# Altium schematic sheet FPGA_IO.SchDoc
size A2
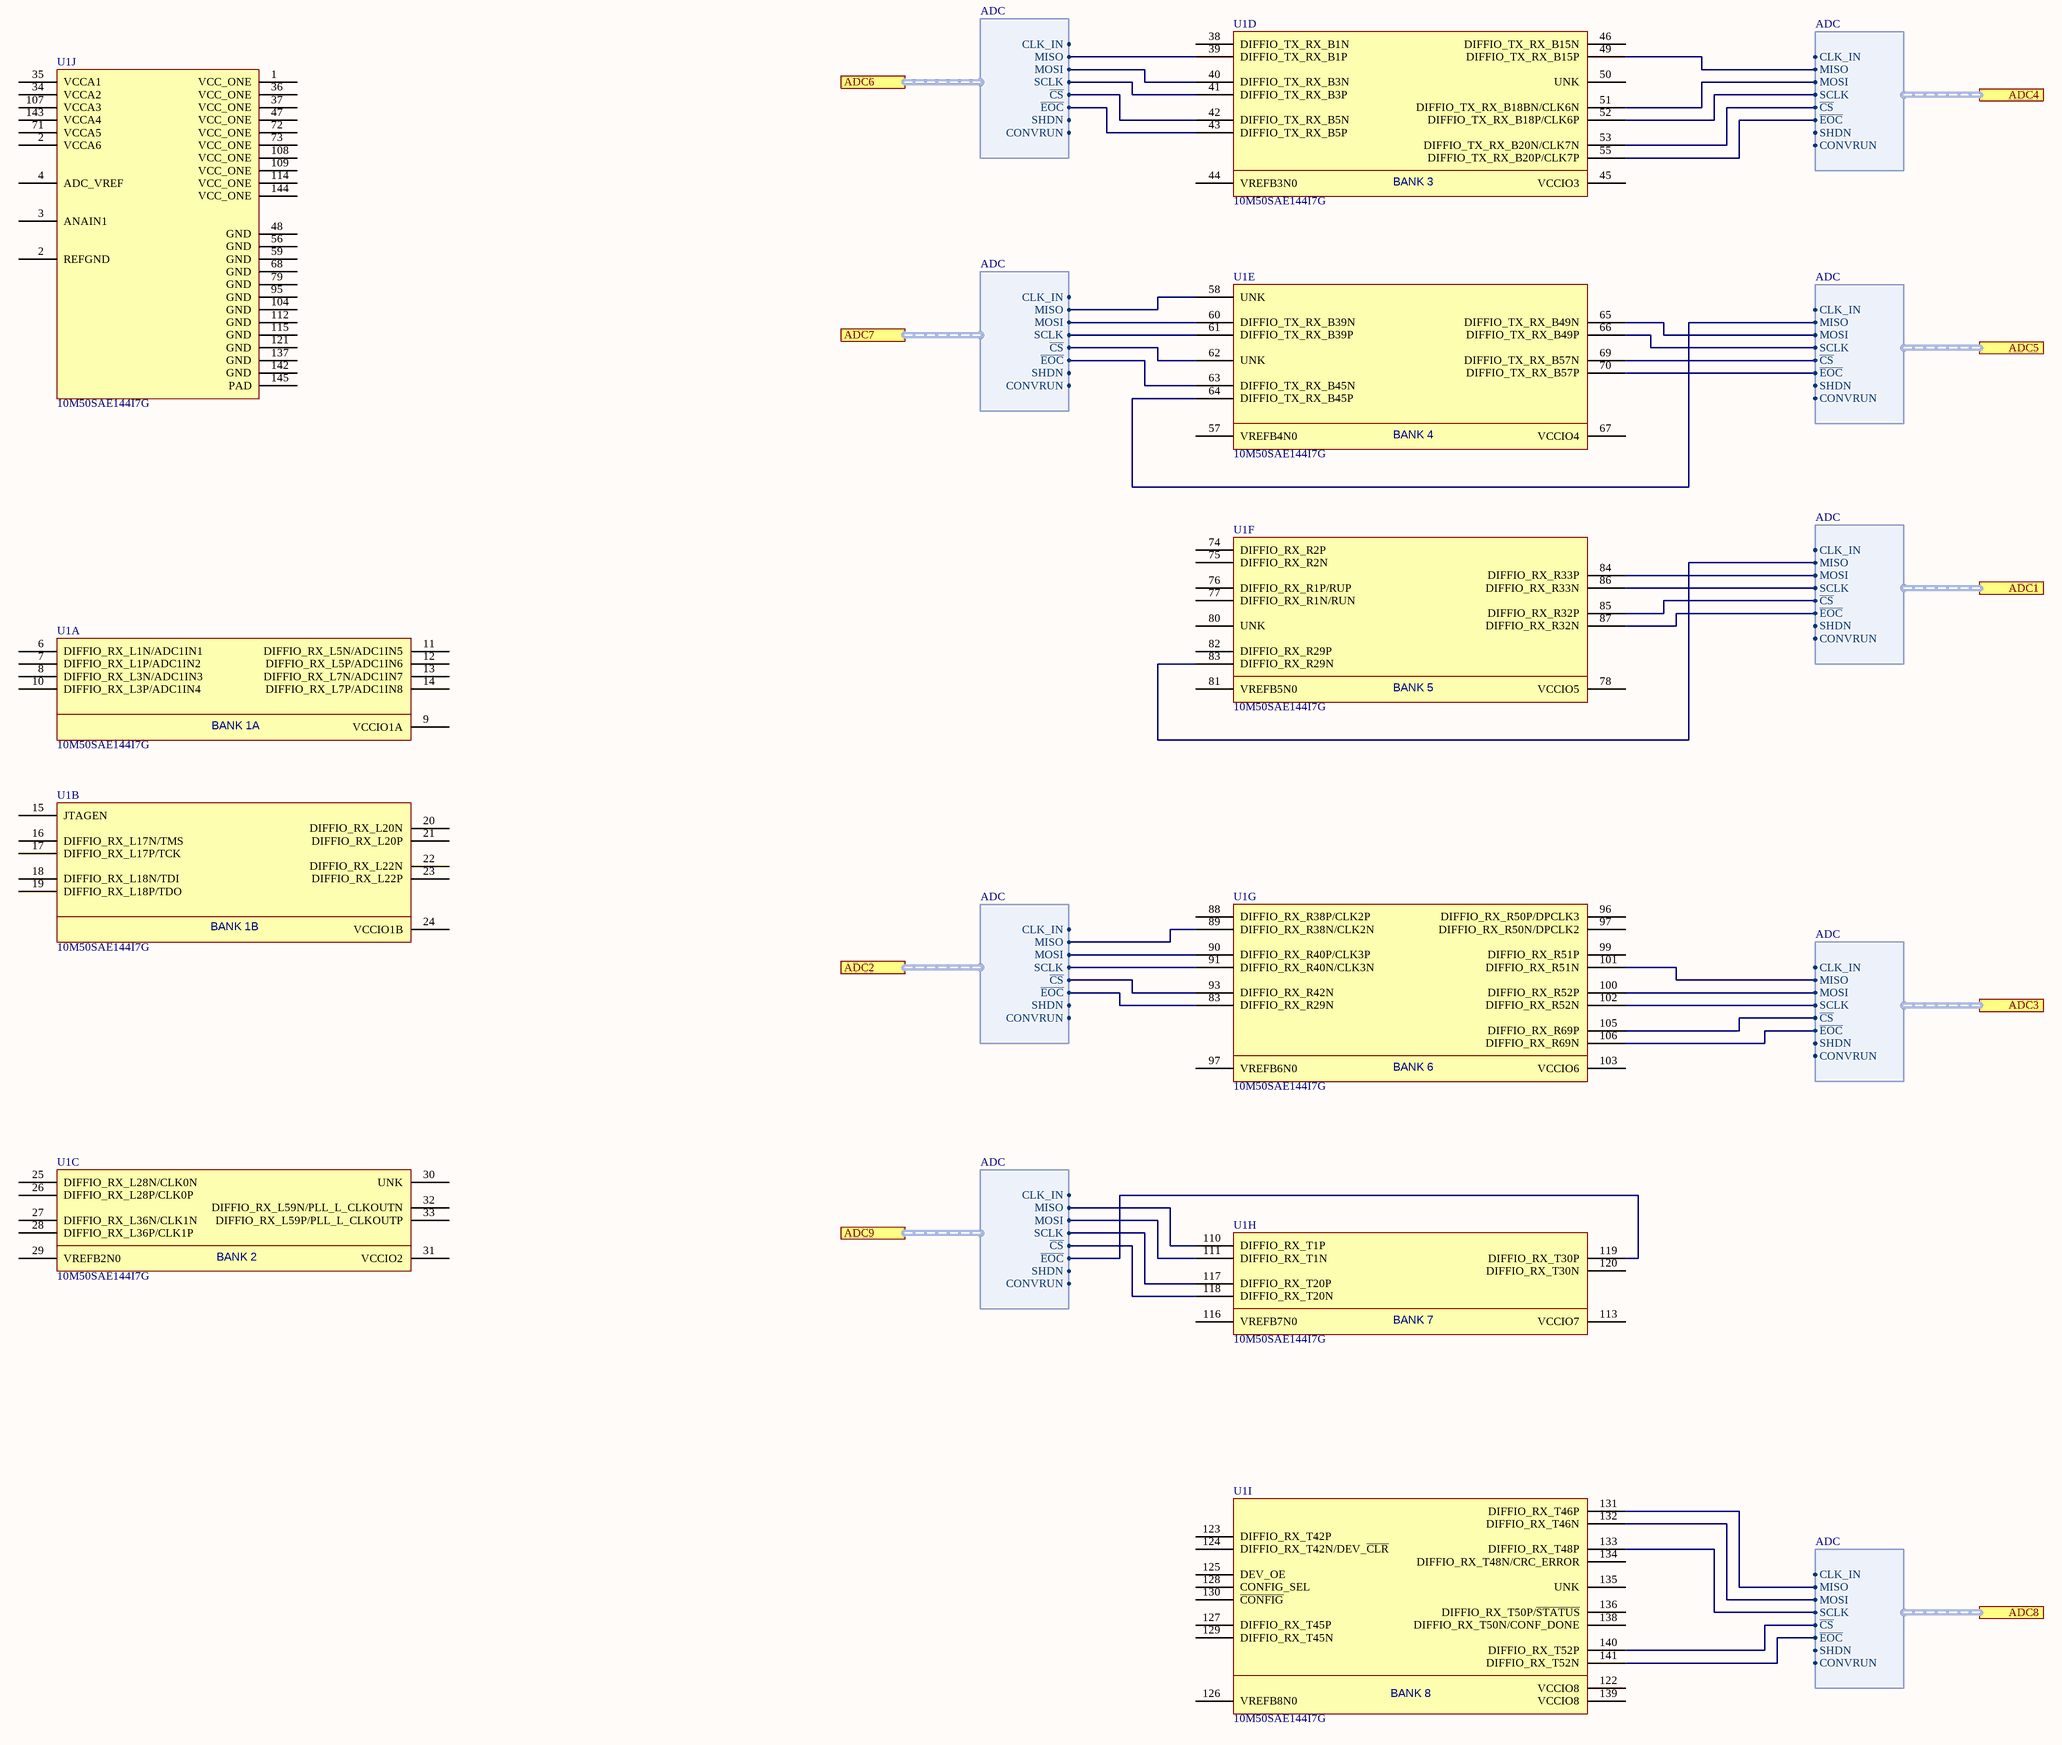
[diagram p0: FPGA_IO.SchDoc]

## Parts
U1  10M50SAE144I7G  [TSQFP50P2200X2200X160_HS-145N]  (parts A,B,C,D,E,F,G,H,I,J of 10)

## Ports
ADC1 (harness ADC), ADC2 (harness ADC), ADC3 (harness ADC), ADC4 (harness ADC), ADC5 (harness ADC), ADC6 (harness ADC), ADC7 (harness ADC), ADC8 (harness ADC), ADC9 (harness ADC)

## Harnesses
ADC: CLK_IN, MISO, MOSI, SCLK, ~{CS}, ~{EOC}, SHDN, CONVRUN

## Nets
NetU1_39: U1.39(DIFFIO_TX_RX_B1P) ; port ADC6.MISO
NetU1_40: U1.40(DIFFIO_TX_RX_B3N) ; port ADC6.MOSI
NetU1_41: U1.41(DIFFIO_TX_RX_B3P) ; port ADC6.SCLK
NetU1_42: U1.42(DIFFIO_TX_RX_B5N) ; port ADC6.~{CS}
NetU1_43: U1.43(DIFFIO_TX_RX_B5P) ; port ADC6.~{EOC}
NetU1_49: U1.49(DIFFIO_TX_RX_B15P) ; port ADC4.MISO
NetU1_51: U1.51(DIFFIO_TX_RX_B18BN/CLK6N) ; port ADC4.MOSI
NetU1_52: U1.52(DIFFIO_TX_RX_B18P/CLK6P) ; port ADC4.SCLK
NetU1_53: U1.53(DIFFIO_TX_RX_B20N/CLK7N) ; port ADC4.~{CS}
NetU1_55: U1.55(DIFFIO_TX_RX_B20P/CLK7P) ; port ADC4.~{EOC}
NetU1_58: U1.58(UNK) ; port ADC7.MISO
NetU1_60: U1.60(DIFFIO_TX_RX_B39N) ; port ADC7.MOSI
NetU1_61: U1.61(DIFFIO_TX_RX_B39P) ; port ADC7.SCLK
NetU1_62: U1.62(UNK) ; port ADC7.~{CS}
NetU1_63: U1.63(DIFFIO_TX_RX_B45N) ; port ADC7.~{EOC}
NetU1_64: U1.64(DIFFIO_TX_RX_B45P) ; port ADC5.MISO
NetU1_65: U1.65(DIFFIO_TX_RX_B49N) ; port ADC5.MOSI
NetU1_66: U1.66(DIFFIO_TX_RX_B49P) ; port ADC5.SCLK
NetU1_69: U1.69(DIFFIO_TX_RX_B57N) ; port ADC5.~{CS}
NetU1_70: U1.70(DIFFIO_TX_RX_B57P) ; port ADC5.~{EOC}
NetU1_83: U1.83(DIFFIO_RX_R29N) ; port ADC1.MISO
NetU1_83: U1.83(DIFFIO_RX_R29N) ; port ADC2.~{EOC}  [a separate net that carries the same name]
NetU1_84: U1.84(DIFFIO_RX_R33P) ; port ADC1.MOSI
NetU1_85: U1.85(DIFFIO_RX_R32P) ; port ADC1.~{CS}
NetU1_86: U1.86(DIFFIO_RX_R33N) ; port ADC1.SCLK
NetU1_87: U1.87(DIFFIO_RX_R32N) ; port ADC1.~{EOC}
NetU1_89: U1.89(DIFFIO_RX_R38N/CLK2N) ; port ADC2.MISO
NetU1_90: U1.90(DIFFIO_RX_R40P/CLK3P) ; port ADC2.MOSI
NetU1_91: U1.91(DIFFIO_RX_R40N/CLK3N) ; port ADC2.SCLK
NetU1_93: U1.93(DIFFIO_RX_R42N) ; port ADC2.~{CS}
NetU1_100: U1.100(DIFFIO_RX_R52P) ; port ADC3.MOSI
NetU1_101: U1.101(DIFFIO_RX_R51N) ; port ADC3.MISO
NetU1_102: U1.102(DIFFIO_RX_R52N) ; port ADC3.SCLK
NetU1_105: U1.105(DIFFIO_RX_R69P) ; port ADC3.~{CS}
NetU1_106: U1.106(DIFFIO_RX_R69N) ; port ADC3.~{EOC}
NetU1_110: U1.110(DIFFIO_RX_T1P) ; port ADC9.MISO
NetU1_111: U1.111(DIFFIO_RX_T1N) ; port ADC9.MOSI
NetU1_117: U1.117(DIFFIO_RX_T20P) ; port ADC9.SCLK
NetU1_118: U1.118(DIFFIO_RX_T20N) ; port ADC9.~{CS}
NetU1_119: U1.119(DIFFIO_RX_T30P) ; port ADC9.~{EOC}
NetU1_131: U1.131(DIFFIO_RX_T46P) ; port ADC8.MISO
NetU1_132: U1.132(DIFFIO_RX_T46N) ; port ADC8.MOSI
NetU1_133: U1.133(DIFFIO_RX_T48P) ; port ADC8.SCLK
NetU1_140: U1.140(DIFFIO_RX_T52P) ; port ADC8.~{CS}
NetU1_141: U1.141(DIFFIO_RX_T52N) ; port ADC8.~{EOC}

Not connected (* = marked no-connect by the designer): U1 1(VCC_ONE) 2(VCCA6) 3(ANAIN1) 4(ADC_VREF) 6(DIFFIO_RX_L1N/ADC1IN1) 7(DIFFIO_RX_L1P/ADC1IN2) 8(DIFFIO_RX_L3N/ADC1IN3) 9(VCCIO1A) 10(DIFFIO_RX_L3P/ADC1IN4) 11(DIFFIO_RX_L5N/ADC1IN5) 12(DIFFIO_RX_L5P/ADC1IN6) 13(DIFFIO_RX_L7N/ADC1IN7) 14(DIFFIO_RX_L7P/ADC1IN8) 15(JTAGEN) 16(DIFFIO_RX_L17N/TMS) 17(DIFFIO_RX_L17P/TCK) 18(DIFFIO_RX_L18N/TDI) 19(DIFFIO_RX_L18P/TDO) 20(DIFFIO_RX_L20N) 21(DIFFIO_RX_L20P) 22(DIFFIO_RX_L22N) 23(DIFFIO_RX_L22P) 24(VCCIO1B) 25(DIFFIO_RX_L28N/CLK0N) 26(DIFFIO_RX_L28P/CLK0P) 27(DIFFIO_RX_L36N/CLK1N) 28(DIFFIO_RX_L36P/CLK1P) 29(VREFB2N0) 30(UNK) 31(VCCIO2) 32(DIFFIO_RX_L59N/PLL_L_CLKOUTN) 33(DIFFIO_RX_L59P/PLL_L_CLKOUTP) 34(VCCA2) 35(VCCA1) 36(VCC_ONE) 37(VCC_ONE) 38(DIFFIO_TX_RX_B1N) 44(VREFB3N0) 45(VCCIO3) 46(DIFFIO_TX_RX_B15N) 47(VCC_ONE) 48(GND) 50(UNK) 56(GND) 57(VREFB4N0) 59(GND) 67(VCCIO4) 68(GND) 71(VCCA5) 72(VCC_ONE) 73(VCC_ONE) 74(DIFFIO_RX_R2P) 75(DIFFIO_RX_R2N) 76(DIFFIO_RX_R1P/RUP) 77(DIFFIO_RX_R1N/RUN) 78(VCCIO5) 79(GND) 80(UNK) 81(VREFB5N0) 82(DIFFIO_RX_R29P) 88(DIFFIO_RX_R38P/CLK2P) 95(GND) 96(DIFFIO_RX_R50P/DPCLK3) 97(VREFB6N0) 99(DIFFIO_RX_R51P) 103(VCCIO6) 104(GND) 107(VCCA3) 108(VCC_ONE) 109(VCC_ONE) 112(GND) 113(VCCIO7) 114(VCC_ONE) 115(GND) 116(VREFB7N0) 120(DIFFIO_RX_T30N) 121(GND) 122(VCCIO8) 123(DIFFIO_RX_T42P) 124(DIFFIO_RX_T42N/DEV_~{CLR}) 125(DEV_OE) 126(VREFB8N0) 127(DIFFIO_RX_T45P) 128(CONFIG_SEL) 129(DIFFIO_RX_T45N) 130(~{CONFIG}) 134(DIFFIO_RX_T48N/CRC_ERROR) 135(UNK) 136(DIFFIO_RX_T50P/~{STATUS}) 137(GND) 138(DIFFIO_RX_T50N/CONF_DONE) 139(VCCIO8) 142(GND) 143(VCCA4) 144(VCC_ONE) 145(PAD)

## Notes on the sheet
- (in symbol 10M50SAE144I7G, part A) BANK 1A
- (in symbol 10M50SAE144I7G, part B) BANK 1B
- (in symbol 10M50SAE144I7G, part C) BANK 2
- (in symbol 10M50SAE144I7G, part D) BANK 3
- (in symbol 10M50SAE144I7G, part E) BANK 4
- (in symbol 10M50SAE144I7G, part F) BANK 5
- (in symbol 10M50SAE144I7G, part G) BANK 6
- (in symbol 10M50SAE144I7G, part H) BANK 7
- (in symbol 10M50SAE144I7G, part I) BANK 8

## Library data of the parts
U1 = 10M50SAE144I7G: IC FPGA 101 I/O 144EQFP